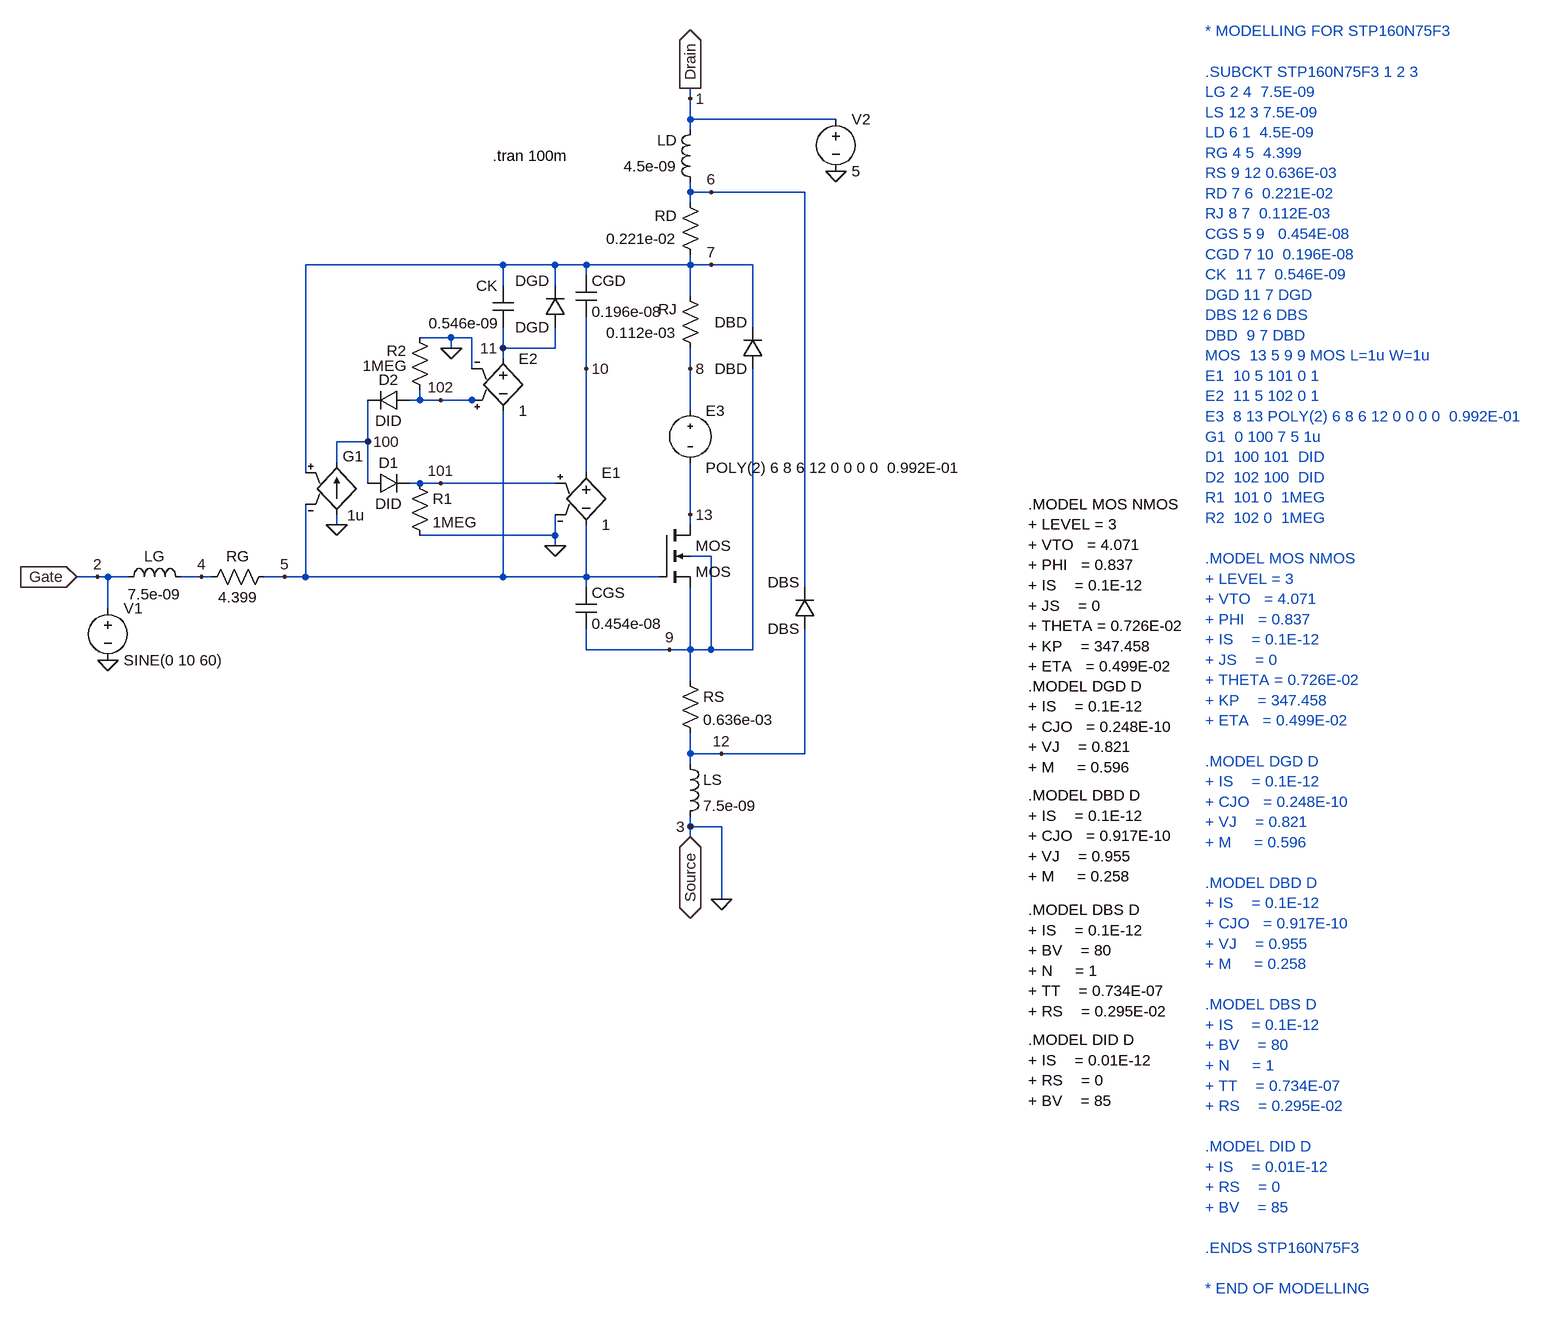
[diagram p0: schematic STP160N75F3.asc]
STP160N75F3.asc, the LTspice schematic file:
Version 4
SHEET 1 1808 1216
WIRE 464 -432 464 -448
WIRE 464 -400 464 -432
WIRE 688 -400 464 -400
WIRE 464 -384 464 -400
WIRE 464 -288 464 -304
WIRE 496 -288 464 -288
WIRE 640 -288 496 -288
WIRE 464 -272 464 -288
WIRE 176 -176 -128 -176
WIRE 256 -176 176 -176
WIRE 304 -176 256 -176
WIRE 464 -176 464 -192
WIRE 464 -176 304 -176
WIRE 496 -176 464 -176
WIRE 560 -176 496 -176
WIRE 304 -160 304 -176
WIRE 176 -144 176 -176
WIRE 256 -144 256 -176
WIRE 464 -128 464 -176
WIRE 560 -80 560 -176
WIRE 96 -64 48 -64
WIRE 128 -64 96 -64
WIRE 96 -48 96 -64
WIRE 176 -48 176 -80
WIRE 256 -48 256 -80
WIRE 256 -48 176 -48
WIRE 176 -32 176 -48
WIRE 128 -16 128 -64
WIRE 304 -16 304 -96
WIRE 464 -16 464 -48
WIRE 48 32 48 16
WIRE 48 32 32 32
WIRE 80 32 48 32
WIRE 128 32 80 32
WIRE 144 32 128 32
WIRE 464 48 464 -16
WIRE -32 96 -32 32
WIRE -32 96 -80 96
WIRE -80 128 -80 96
WIRE -128 144 -128 -176
WIRE 304 144 304 -16
WIRE -32 160 -32 96
WIRE 48 160 32 160
WIRE 80 160 48 160
WIRE 256 160 80 160
WIRE 464 208 464 128
WIRE -80 224 -80 208
WIRE 464 224 464 208
WIRE 256 240 256 208
WIRE 256 240 48 240
WIRE 256 256 256 240
WIRE 496 272 464 272
WIRE -448 304 -480 304
WIRE -432 304 -448 304
WIRE -400 304 -432 304
WIRE -288 304 -320 304
WIRE -272 304 -288 304
WIRE -160 304 -192 304
WIRE -128 304 -128 192
WIRE -128 304 -160 304
WIRE 176 304 176 48
WIRE 176 304 -128 304
WIRE 304 304 304 224
WIRE 304 304 176 304
WIRE 416 304 304 304
WIRE 304 320 304 304
WIRE 640 320 640 -288
WIRE -432 352 -432 304
WIRE 304 416 304 384
WIRE 432 416 304 416
WIRE 464 416 464 320
WIRE 464 416 432 416
WIRE 496 416 496 272
WIRE 496 416 464 416
WIRE 560 416 560 -16
WIRE 560 416 496 416
WIRE 464 464 464 416
WIRE 464 576 464 544
WIRE 512 576 464 576
WIRE 640 576 640 384
WIRE 640 576 512 576
WIRE 464 592 464 576
WIRE 464 688 464 672
WIRE 512 688 464 688
WIRE 464 704 464 688
WIRE 512 800 512 688
FLAG -288 304 4
FLAG 464 688 3
FLAG 464 -432 1
FLAG -160 304 5
FLAG 496 -288 6
FLAG 496 -176 7
FLAG 432 416 9
FLAG 512 576 12
FLAG 464 -16 8
FLAG 176 -48 11
FLAG 304 -16 10
FLAG 464 208 13
FLAG -80 224 0
FLAG -32 96 100
FLAG 80 160 101
FLAG 256 256 0
FLAG 80 32 102
FLAG 96 -48 0
FLAG 464 -448 Drain
IOPIN 464 -448 Out
FLAG -480 304 Gate
IOPIN -480 304 In
FLAG 464 704 Source
IOPIN 464 704 BiDir
FLAG 512 800 0
FLAG -432 432 0
FLAG 688 -320 0
FLAG -448 304 2
SYMBOL ind -416 320 R270
WINDOW 0 32 56 VTop 0
WINDOW 3 5 56 VBottom 0
SYMATTR InstName LG
SYMATTR Value 7.5e-09
SYMBOL ind 448 576 R0
SYMATTR InstName LS
SYMATTR Value 7.5e-09
SYMBOL ind 480 -288 R180
WINDOW 0 36 80 Left 0
WINDOW 3 36 40 Left 0
SYMATTR InstName LD
SYMATTR Value 4.5e-09
SYMBOL res -288 320 R270
WINDOW 0 32 56 VTop 0
WINDOW 3 0 56 VBottom 0
SYMATTR InstName RG
SYMATTR Value 4.399
SYMBOL res 448 448 R0
SYMATTR InstName RS
SYMATTR Value 0.636e-03
SYMBOL res 480 -176 R180
WINDOW 0 36 76 Left 0
WINDOW 3 36 40 Left 0
SYMATTR InstName RD
SYMATTR Value 0.221e-02
SYMBOL res 480 -32 R180
WINDOW 0 36 76 Left 0
WINDOW 3 36 40 Left 0
SYMATTR InstName RJ
SYMATTR Value 0.112e-03
SYMBOL cap 288 320 R0
SYMATTR InstName CGS
SYMATTR Value 0.454e-08
SYMBOL cap 288 -160 R0
SYMATTR InstName CGD
SYMATTR Value 0.196e-08
SYMBOL cap 192 -80 R180
WINDOW 0 24 64 Left 0
WINDOW 3 21 6 Left 0
SYMATTR InstName CK
SYMATTR Value 0.546e-09
SYMBOL diode 272 -80 R180
WINDOW 0 24 72 Left 0
WINDOW 3 24 0 Left 0
SYMATTR InstName DGD
SYMATTR Value DGD
SYMBOL diode 656 384 R180
WINDOW 0 24 72 Left 0
WINDOW 3 24 0 Left 0
SYMATTR InstName DBS
SYMATTR Value DBS
SYMBOL diode 576 -16 R180
WINDOW 0 24 72 Left 0
WINDOW 3 24 0 Left 0
SYMATTR InstName DBD
SYMATTR Value DBD
SYMBOL nmos4 416 224 R0
SYMATTR InstName MOS
SYMATTR Value MOS
SYMATTR Value2 l=1u w=1u
SYMBOL e 304 128 R0
SYMATTR InstName E1
SYMATTR Value 1
SYMBOL e2 176 -48 R0
SYMATTR InstName E2
SYMATTR Value 1
SYMBOL Misc\\Epoly 464 32 R0
SYMATTR InstName E3
SYMATTR Value POLY(2) 6 8 6 12 0 0 0 0  0.992E-01
SYMBOL g -80 112 R0
WINDOW 0 9 6 Left 0
WINDOW 3 16 97 Left 0
SYMATTR InstName G1
SYMATTR Value 1u
SYMBOL diode -32 176 R270
WINDOW 0 32 32 VTop 0
WINDOW 3 0 32 VBottom 0
SYMATTR InstName D1
SYMATTR Value DID
SYMBOL diode 32 16 R90
WINDOW 0 0 32 VBottom 0
WINDOW 3 32 32 VTop 0
SYMATTR InstName D2
SYMATTR Value DID
SYMBOL res 32 144 R0
SYMATTR InstName R1
SYMATTR Value 1MEG
SYMBOL res 64 32 R180
WINDOW 0 36 76 Left 0
WINDOW 3 36 53 Left 0
SYMATTR InstName R2
SYMATTR Value 1MEG
SYMBOL voltage -432 336 R0
WINDOW 123 0 0 Left 0
WINDOW 39 0 0 Left 0
SYMATTR InstName V1
SYMATTR Value SINE(0 10 60)
SYMBOL voltage 688 -416 R0
WINDOW 123 0 0 Left 0
WINDOW 39 0 0 Left 0
SYMATTR InstName V2
SYMATTR Value 5
TEXT 1256 -536 Left 0 ;* MODELLING FOR STP160N75F3\n \n.SUBCKT STP160N75F3 1 2 3\nLG 2 4  7.5E-09\nLS 12 3 7.5E-09\nLD 6 1  4.5E-09\nRG 4 5  4.399\nRS 9 12 0.636E-03\nRD 7 6  0.221E-02\nRJ 8 7  0.112E-03\nCGS 5 9   0.454E-08\nCGD 7 10  0.196E-08\nCK  11 7  0.546E-09\nDGD 11 7 DGD\nDBS 12 6 DBS\nDBD  9 7 DBD\nMOS  13 5 9 9 MOS L=1u W=1u\nE1  10 5 101 0 1\nE2  11 5 102 0 1\nE3  8 13 POLY(2) 6 8 6 12 0 0 0 0  0.992E-01\nG1  0 100 7 5 1u\nD1  100 101  DID\nD2  102 100  DID\nR1  101 0  1MEG\nR2  102 0  1MEG\n \n.MODEL MOS NMOS\n+ LEVEL = 3\n+ VTO   = 4.071\n+ PHI   = 0.837\n+ IS    = 0.1E-12\n+ JS    = 0\n+ THETA = 0.726E-02\n+ KP    = 347.458\n+ ETA   = 0.499E-02\n \n.MODEL DGD D\n+ IS    = 0.1E-12\n+ CJO   = 0.248E-10\n+ VJ    = 0.821\n+ M     = 0.596\n \n.MODEL DBD D\n+ IS    = 0.1E-12\n+ CJO   = 0.917E-10\n+ VJ    = 0.955\n+ M     = 0.258\n \n.MODEL DBS D\n+ IS    = 0.1E-12\n+ BV    = 80\n+ N     = 1\n+ TT    = 0.734E-07\n+ RS    = 0.295E-02\n \n.MODEL DID D\n+ IS    = 0.01E-12\n+ RS    = 0\n+ BV    = 85\n \n.ENDS STP160N75F3\n \n* END OF MODELLING
TEXT 984 192 Left 0 !.MODEL MOS NMOS\n+ LEVEL = 3\n+ VTO   = 4.071\n+ PHI   = 0.837\n+ IS    = 0.1E-12\n+ JS    = 0\n+ THETA = 0.726E-02\n+ KP    = 347.458\n+ ETA   = 0.499E-02
TEXT 984 472 Left 0 !.MODEL DGD D\n+ IS    = 0.1E-12\n+ CJO   = 0.248E-10\n+ VJ    = 0.821\n+ M     = 0.596
TEXT 984 640 Left 0 !.MODEL DBD D\n+ IS    = 0.1E-12\n+ CJO   = 0.917E-10\n+ VJ    = 0.955\n+ M     = 0.258
TEXT 984 816 Left 0 !.MODEL DBS D\n+ IS    = 0.1E-12\n+ BV    = 80\n+ N     = 1\n+ TT    = 0.734E-07\n+ RS    = 0.295E-02
TEXT 984 1016 Left 0 !.MODEL DID D\n+ IS    = 0.01E-12\n+ RS    = 0\n+ BV    = 85
TEXT 160 -344 Left 0 !.tran 100m

The netlist it stands for:
* STP160N75F3.asc
LG 2 4 7.5e-09
LS 12 0 7.5e-09
LD 6 Drain 4.5e-09
RG 4 5 4.399
RS 9 12 0.636e-03
RD 7 6 0.221e-02
RJ 8 7 0.112e-03
CGS 5 9 0.454e-08
CGD 7 10 0.196e-08
CK 11 7 0.546e-09
DGD 11 7 DGD
DBS 12 6 DBS
DBD 9 7 DBD
MOS 13 5 9 9 MOS l=1u w=1u
E1 10 5 101 0 1
E2 11 5 102 0 1
E3 8 13 POLY(2) 6 8 6 12 0 0 0 0  0.992E-01
G1 0 100 7 5 1u
D1 100 101 DID
D2 102 100 DID
R1 101 0 1MEG
R2 102 0 1MEG
V1 2 0 SINE(0 10 60)
V2 Drain 0 5
.model D D
.lib standard.dio
.model NMOS NMOS
.model PMOS PMOS
.lib standard.mos
* * MODELLING FOR STP160N75F3
* .SUBCKT STP160N75F3 1 2 3
* LG 2 4  7.5E-09
* LS 12 3 7.5E-09
* LD 6 1  4.5E-09
* RG 4 5  4.399
* RS 9 12 0.636E-03
* RD 7 6  0.221E-02
* RJ 8 7  0.112E-03
* CGS 5 9   0.454E-08
* CGD 7 10  0.196E-08
* CK  11 7  0.546E-09
* DGD 11 7 DGD
* DBS 12 6 DBS
* DBD  9 7 DBD
* MOS  13 5 9 9 MOS L=1u W=1u
* E1  10 5 101 0 1
* E2  11 5 102 0 1
* E3  8 13 POLY(2) 6 8 6 12 0 0 0 0  0.992E-01
* G1  0 100 7 5 1u
* D1  100 101  DID
* D2  102 100  DID
* R1  101 0  1MEG
* R2  102 0  1MEG
* .MODEL MOS NMOS
* + LEVEL = 3
* + VTO   = 4.071
* + PHI   = 0.837
* + IS    = 0.1E-12
* + JS    = 0
* + THETA = 0.726E-02
* + KP    = 347.458
* + ETA   = 0.499E-02
* .MODEL DGD D
* + IS    = 0.1E-12
* + CJO   = 0.248E-10
* + VJ    = 0.821
* + M     = 0.596
* .MODEL DBD D
* + IS    = 0.1E-12
* + CJO   = 0.917E-10
* + VJ    = 0.955
* + M     = 0.258
* .MODEL DBS D
* + IS    = 0.1E-12
* + BV    = 80
* + N     = 1
* + TT    = 0.734E-07
* + RS    = 0.295E-02
* .MODEL DID D
* + IS    = 0.01E-12
* + RS    = 0
* + BV    = 85
* .ENDS STP160N75F3
* * END OF MODELLING
.MODEL MOS NMOS
+ LEVEL = 3
+ VTO   = 4.071
+ PHI   = 0.837
+ IS    = 0.1E-12
+ JS    = 0
+ THETA = 0.726E-02
+ KP    = 347.458
+ ETA   = 0.499E-02
.MODEL DGD D
+ IS    = 0.1E-12
+ CJO   = 0.248E-10
+ VJ    = 0.821
+ M     = 0.596
.MODEL DBD D
+ IS    = 0.1E-12
+ CJO   = 0.917E-10
+ VJ    = 0.955
+ M     = 0.258
.MODEL DBS D
+ IS    = 0.1E-12
+ BV    = 80
+ N     = 1
+ TT    = 0.734E-07
+ RS    = 0.295E-02
.MODEL DID D
+ IS    = 0.01E-12
+ RS    = 0
+ BV    = 85
.tran 100m
.backanno
.end